# EAGLE design base_module_e1 (EAGLE 9.2.2)
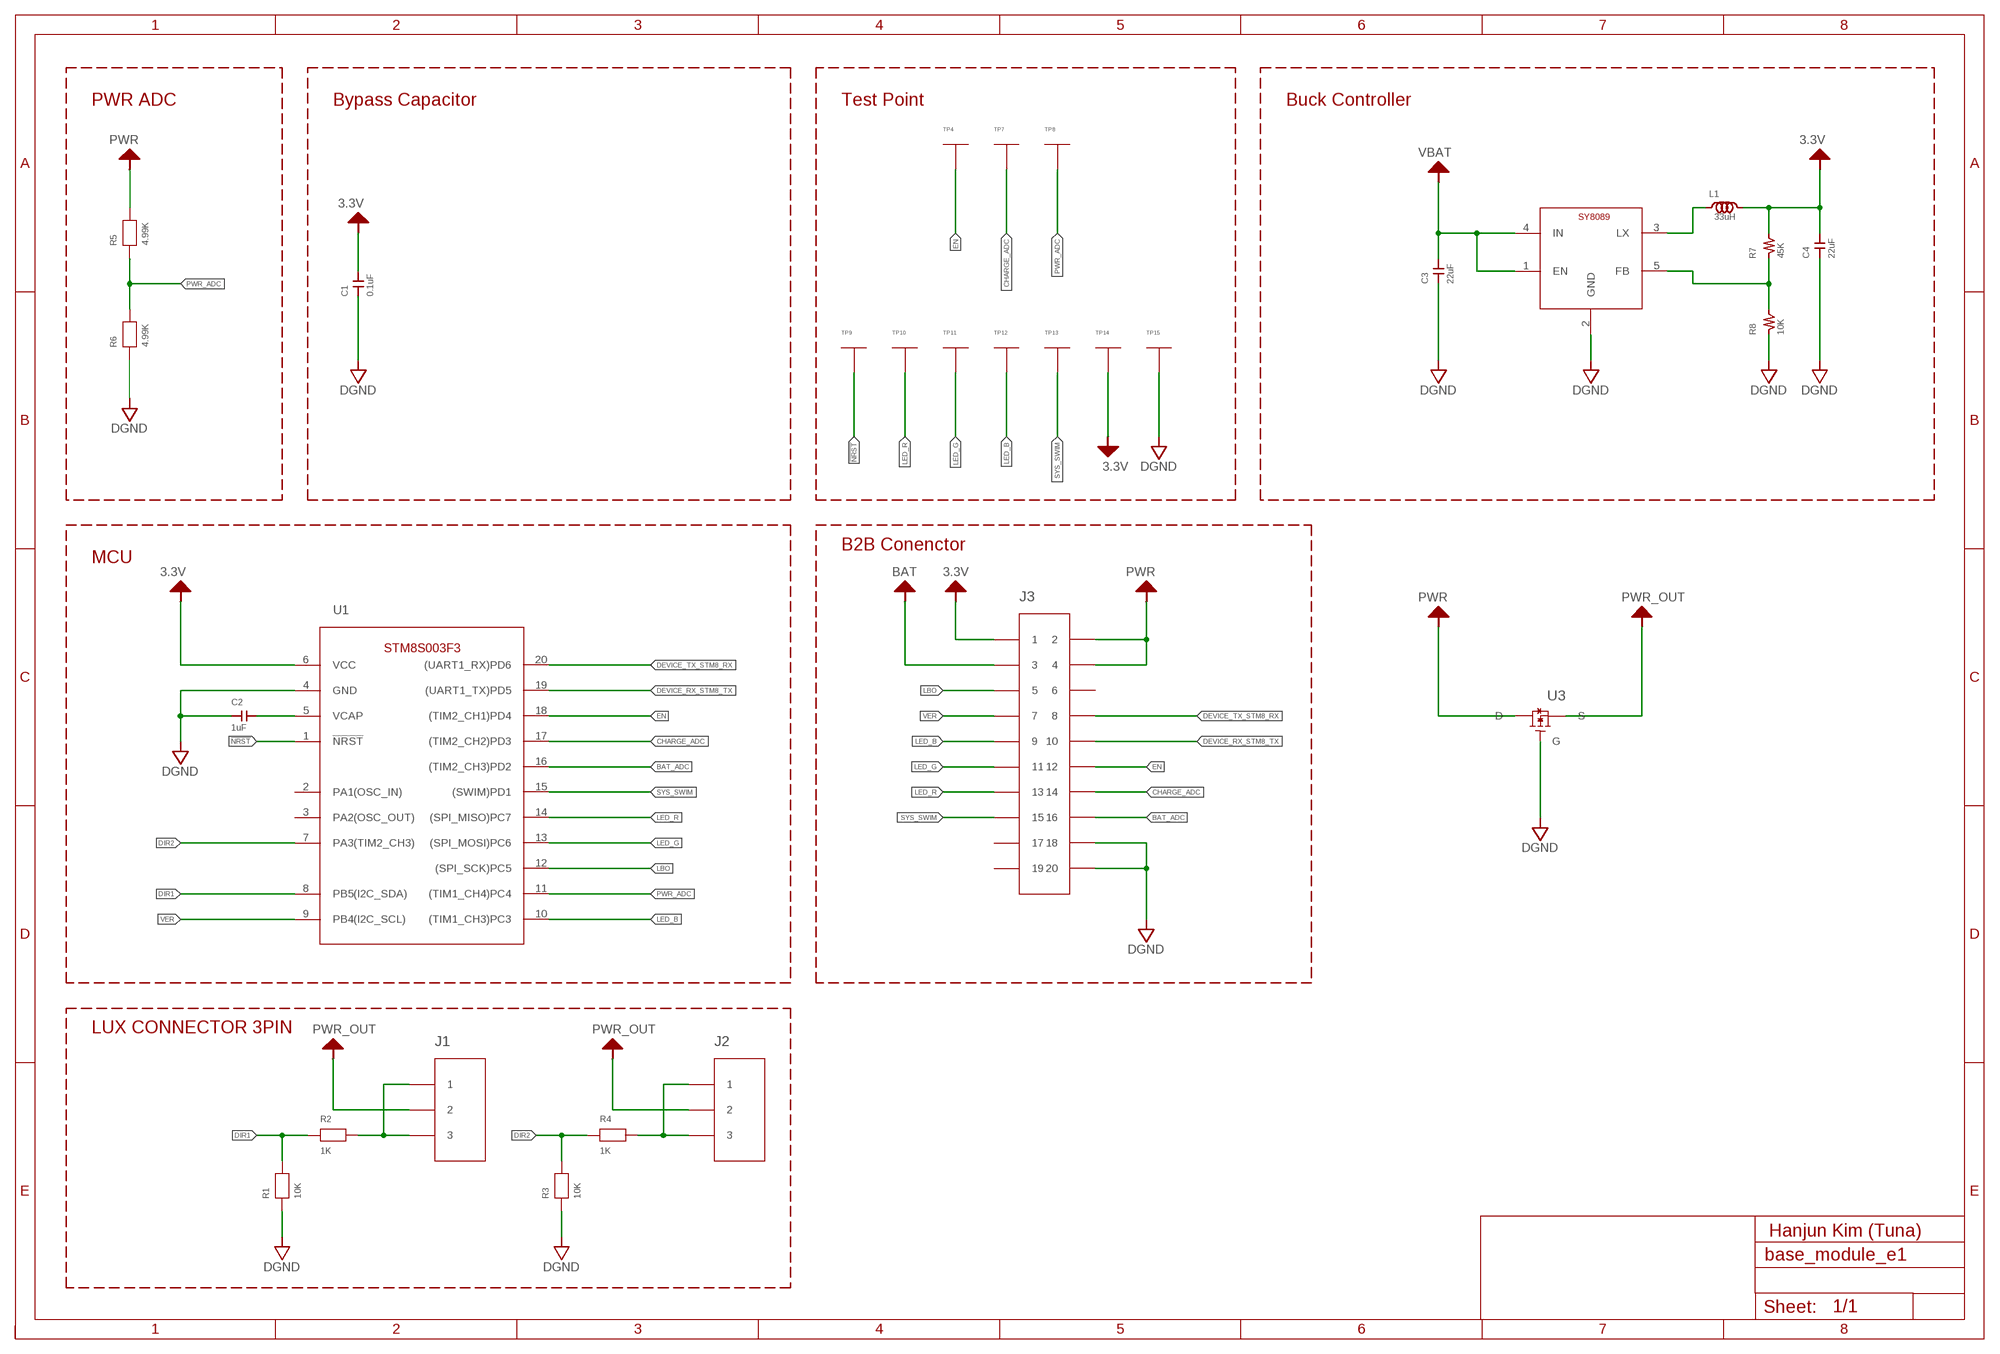
[diagram p0: schematic, sheet 1]

## Parts
C1  0.1uF  CAPACITOR_CHIP1005  [1005]
C2  1uF  CAPACITOR_CHIP1005  [1005]
C3  22uF  CAPACITOR_CHIP1608  [1608]
C4  22uF  CAPACITOR_CHIP1608  [1608]
J1  MODI_CONNECTOR_BOTTOM  [3P]
J2  MODI_CONNECTOR_BOTTOM  [3P]
J3  AXK720447G  [SOCKET_20P]
L1  33uH  INDUCTOR2518  [2518]
P1  MODI_BAT_BASE  [BAT_BASE]
R1  10K  RESISTOR_CHIP_SMALL1005  [1005]
R2  1K  RESISTOR_CHIP_SMALL1005  [1005]
R3  10K  RESISTOR_CHIP_SMALL1005  [1005]
R4  1K  RESISTOR_CHIP_SMALL1005  [1005]
R5  4.99K  RESISTOR_CHIP_SMALL1005  [1005]
R6  4.99K  RESISTOR_CHIP_SMALL1005  [1005]
R7  45K  RESISTOR_CHIP_1005  [1005]
R8  10K  RESISTOR_CHIP_1005  [1005]
TP4  TEST_POINT_1.2MM_PAD  [1.2MM_PAD]
TP7  TEST_POINT_1.2MM_PAD  [1.2MM_PAD]
TP8  TEST_POINT_1.2MM_PAD  [1.2MM_PAD]
TP9  TEST_POINT_1.2MM_PAD  [1.2MM_PAD]
TP10  TEST_POINT_1.2MM_PAD  [1.2MM_PAD]
TP11  TEST_POINT_1.2MM_PAD  [1.2MM_PAD]
TP12  TEST_POINT_1.2MM_PAD  [1.2MM_PAD]
TP13  TEST_POINT  [0.7MM_HOLE]
TP14  TEST_POINT  [0.7MM_HOLE]
TP15  TEST_POINT  [0.7MM_HOLE]
U1  STM8S003FXU6  [UFQFPN20]
U2  SY8089  [SOT-23-5]
U3  PMXBXXXXPE  [DFN1010D-3]

## Nets
3.3V: C1.P$2 C4.P$2 J3.P1 L1.P$2 R7.P$2 TP14.1 U1.6(VCC)
!NRST!: TP9.P1 U1.1(!NRST!)
BAT_ADC: J3.P16 U1.16((TIM2_CH3)PD2)
CHARGE_ADC: J3.P14 TP7.P1 U1.17((TIM2_CH2)PD3)
DEVICE_RX_STM8_TX: J3.P10 U1.19((UART1_TX)PD5)
DEVICE_TX_STM8_RX: J3.P8 U1.20((UART1_RX)PD6)
DGND: C1.P$1 C2.P$1 C3.P$1 C4.P$1 J3.P18 J3.P20 R1.P$1 R3.P$1 R6.P$1 R8.P$1 TP15.1 U1.4(GND) U2.2(GND) U3.P1(G)
DIR1: R1.P$2 R2.P$1 U1.8(PB5(I2C_SDA))
DIR2: R3.P$2 R4.P$1 U1.7(PA3(TIM2_CH3))
EN: J3.P12 TP4.P1 U1.18((TIM2_CH1)PD4)
LBO: J3.P5 U1.12((SPI_SCK)PC5)
LED_B: J3.P9 TP12.P1 U1.10((TIM1_CH3)PC3)
LED_G: J3.P11 TP11.P1 U1.13((SPI_MOSI)PC6)
LED_R: J3.P13 TP10.P1 U1.14((SPI_MISO)PC7)
N$1: J2.P1 J2.P3 R4.P$2
N$3: J1.P1 J1.P3 R2.P$2
N$4: R7.P$1 R8.P$2 U2.5(FB)
N$5: L1.P$1 U2.3(LX)
PWR: J3.P2 J3.P4 R5.P$2 U3.P3(D)
PWR_ADC: R5.P$1 R6.P$2 TP8.P1 U1.11((TIM1_CH4)PC4)
PWR_OUT: J1.P2 J2.P2 U3.P2(S)
SYS_SWIM: J3.P15 TP13.1 U1.15((SWIM)PD1)
VBAT: C3.P$2 J3.P3 U2.1(EN) U2.4(IN) ; supply symbol labelled BAT
VCAP: C2.P$2 U1.5(VCAP)
VER: J3.P7 U1.9(PB4(I2C_SCL))
Unconnected: J3.P6 J3.P17 J3.P19 U1.2(PA1(OSC_IN)) U1.3(PA2(OSC_OUT))

## Notes on the sheet
- PWR ADC | Bypass Capacitor | Test Point | Buck Controller
- B2B Conenctor
- MCU
- LUX CONNECTOR 3PIN
- Hanjun Kim (Tuna)

## Library data of the parts
C1-C4 = passive:CAPACITOR_CHIP
J1 J2 = MODI_Connector:MODI_CONNECTOR_BOTTOM
J3 = connector-panasonic:AXK7204
L1 = passive:INDUCTOR
P1 = MODI_board:MODI_BAT_BASE
R1-R6 = passive:RESISTOR_CHIP_SMALL
R7 R8 = passive:RESISTOR_CHIP_
TP4 TP7-TP15 = Test:TEST_POINT
U1 = ST-MCU:STM8S003FX: • 16 MHz advanced STM8 core with Harvard architecture and 3-stage pipeline • Extended instruction set Memories • Program memory: 8 Kbyte Flash memory; data retention 20 years at 55 °C after 100 cycles • RAM: 1 Kbyte • Data memory: 128 bytes true data EEPROM; endurance up to 100 k write/erase cycles Clock, reset and supply management • 2.95 V to 5.5 V operating voltage • Flexible clock control, 4 master clock sources – Low-power crystal resonator oscillator – External clock input – Internal, user-trimmable 16 MHz RC – Internal low-power 128 kHz RC • Clock security system with clock monitor • Power management – Low-power modes (wait, active-halt, halt) – Switch-off peripheral clocks individually – Permanently active, low-consumption power-on and power-down reset Interrupt management • Nested interrupt controller with 32 interrupts • Up to 27 external interrupts on 6 vectors
U2 = Regulator:SY8089: The SY8089 and SY8089A are high-efficiency, high frequency synchronous step-down DC-DC regulator IC capable of delivering up to 2A output current. The SY8089 and SY8089A operate over a wide input voltage range from 2.7V to 5.5V and integrate main switch and synchronous switch with very low RDS(ON) to minimize the conduction loss. Low output voltage ripple and small external inductor and capacitor sizes are achieved with greater than 1MHz switching frequency. SY8089 integrates short circuit and over-voltage latch off protection.
U3 = MOSFET:PMXBXXXX

## Board
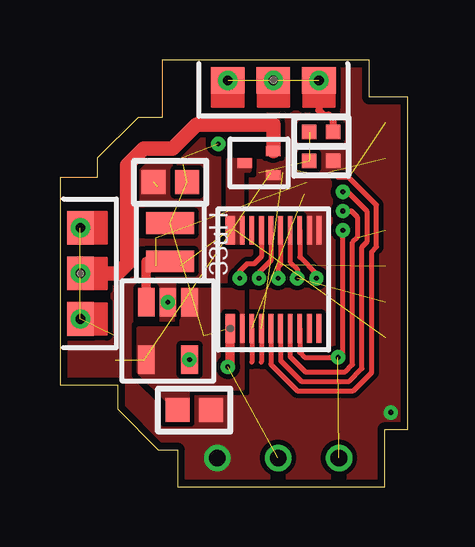
[diagram p1: board, top side]
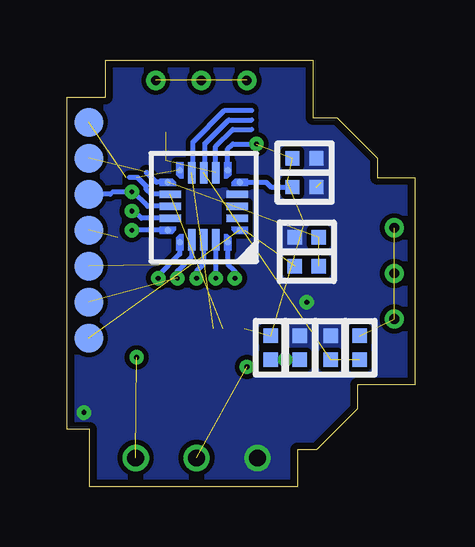
[diagram p2: board, bottom side, seen from below]

Size 14.5 x 17.8 mm. Coordinates in mm from the lower left corner, seen from the top.
Copper layers (1*16): Top 0.035mm / dielectric 0.2mm / Bottom 0.035mm
Design rules "hsdgt3_1oz_2layer": minimum track width 0.2mm, minimum drill 0.2mm, track to track 0.2mm, track to pad 0.2mm, pad to pad 0.2mm, via to via 0.2mm, smd to smd 0mil, copper to edge 0.3mm, drill to drill 8mil, minimum pad ring 0.2mm, minimum via ring 0.2mm, stop-mask expansion 0mil, vias tented up to drill 0.3mm, thermal gap 10mil

### Footprints (pad centres in the part's own frame; a part is rotated, then mirrored left to right if it is on the bottom)
1005 = smd 0.6 x 0.6: P$1 0,0.5; P$2 0,-0.5
1608 = smd 1 x 1: P$1 0,0.7; P$2 0,-0.7
3P = smd 1.1 x 1.4: P1 0,1.9; P2 0,0; P3 0,-1.9
SOCKET_20P = smd 1.2 x 0.4: P1 0,0.1; P2 4.1,0.1 | smd 1.2 x 0.2: P3 0,-0.4; P4 4.1,-0.4; P5 0,-0.8; P6 4.1,-0.8; P7 0,-1.2; P8 4.1,-1.2; P9 0,-1.6; P10 4.1,-1.6; P11 0,-2; P12 4.1,-2; P13 0,-2.4; P14 4.1,-2.4; P15 0,-2.8; P16 4.1,-2.8; P17 0,-3.2; P18 4.1,-3.2; P19 0,-3.6; P20 4.1,-3.6
2518 = smd 0.9 x 2: P$1 -0.8,0; P$2 0.8,0
1.2MM_PAD = smd 1.2 x 1.2: P1 0,0
0.7MM_HOLE = drill 0.7: 1 0,0
UFQFPN20 = smd 0.3 x 0.3: 1 -1.5,1; 5 -1.5,-1; 6 -1,-1.5; 10 1,-1.5; 11 1.5,-1; 15 1.5,1; 16 1,1.5; 20 -1,1.5 | smd 0.9 x 0.3: 2 -1.4,0.5; 3 -1.4,0; 4 -1.4,-0.5; 12 1.4,-0.5; 13 1.4,0; 14 1.4,0.5 | smd 0.3 x 0.9: 7 -0.5,-1.4; 8 0,-1.4; 9 0.5,-1.4; 17 0.5,1.4; 18 0,1.4; 19 -0.5,1.4
SOT-23-5 = smd 0.7 x 1.2: 1 1.8,0; 2 0.9,0; 3 0,0; 4 0,-2.4; 5 1.8,-2.4
DFN1010D-3 = smd 0.4 x 0.6: P1 0.5,0.9; P2 -0.5,0.9; P3 0,-0.3

### Placement (x,y rotation side)
C1  4.6,13.7 270 bottom
C2  4.6,12.5 270 bottom
C3  5.6,3.2 270 top
C4  4.6,12.7 90 top
J1  0.85,8.9 0 top
J2  8.9,16.95 270 top
J3  7.2,6.6 90 top
L1  4.6,10.2 90 top
P1  4.9,0 0 top
R1  3.5,5.8 0 bottom
R2  2.3,5.8 180 bottom
R3  10.9,13.6 270 top
R4  10.9,14.8 90 top
R5  4.5,9.2 270 bottom
R6  4.5,10.4 90 bottom
R7  6,5.8 180 bottom
R8  4.8,5.8 0 bottom
TP4  13.6,9.2 0 bottom
TP7  13.6,7.7 180 bottom
TP8  13.6,13.7 0 bottom
TP9  13.6,6.2 0 bottom
TP10  13.6,10.7 0 bottom
TP11  13.6,12.2 0 bottom
TP12  13.6,15.2 0 bottom
TP13  11.64,1.2 0 top
TP14  9.1,1.2 0 top
TP15  6.56,1.2 0 top
U1  8.8,11.7 180 bottom
U2  3.6,7.7 0 top
U3  8,13.5 270 top

### Tracks (layer width: path | path; a pad name or v marks a point on that pad's centre or on a via)
3.3V  (via drill 0.2)  (6 unrouted)
  Top 0.4: J3.P1 7.1,5.1 v7,5
  Bottom 0.2: U1.6 7.8,14.1 7.6,14.3 v6.6,14.3
!NRST!  (1 unrouted)
BAT_ADC  (via drill 0.2)
  Top 0.2: J3.P16 10,9.58 10.7,8.88 v10.7,8.7
  Bottom 0.2: U1.16 9.8,9.7 10.7,8.8 v10.7,8.7
CHARGE_ADC  (via drill 0.2)  (1 unrouted)
  Top 0.2: J3.P14 9.6,9.38 9.9,9.08 v9.9,8.7
  Bottom 0.2: v9.9,8.7 9.9,9 9.3,9.6 U1.17
DEVICE_RX_STM8_TX  (via drill 0.2)
  Top 0.2: J3.P10 8.8,9.43 8.3,8.93 v8.3,8.7
  Bottom 0.2: U1.19 v8.3,8.7
DEVICE_TX_STM8_RX  (via drill 0.2)
  Top 0.2: J3.P8 8.4,9.6 8.1,9.3 7.8,9.3 7.5,9 v7.5,8.7
  Bottom 0.2: U1.20 7.8,9.3 7.5,9 v7.5,8.7
DGND  (via drill 0.2)  (1 unrouted)
  other vias: 4.5,7.7 13.8,3.1
  pour Bottom (isolate 0.2, rank 6, no thermals): -0.4,19.7 14.6,19.7 14.6,-0.3 -0.4,-0.3
  pour Top (isolate 0.2, rank 6, no thermals): -0.4,19.7 14.6,19.7 14.6,-0.3 -0.4,-0.3
DIR1  (2 unrouted)
  Bottom 0.2: U1.8 8.75,13.15 8.75,14.32 7.77,15.3 6.8,15.3
DIR2  (2 unrouted)
  Bottom 0.2: U1.7 8.3,14.2 7.6,14.9 6.8,14.9
EN  (via drill 0.2)  (1 unrouted)
  Top 0.2: J3.P12 9.2,9.27 9.1,9.17 v9.1,8.7
  Bottom 0.2: U1.18 8.8,9.3 9.1,9 v9.1,8.7
LBO  (1 unrouted)
  Top 0.2: J3.P5 8,5.2
  Bottom 0.2: U1.12 11,12.2 11.2,12.4 11.2,12.55 11.55,12.9 11.9,12.9
LED_B  (2 unrouted)
  Top 0.2: J3.P9 8.8,5.1 9.9,4 12.23,4 13,4.77 13,9.8 13.2,10 13.2,11.75 12.05,12.9 11.6,12.9
LED_G  (via drill 0.2)
  Top 0.2: J3.P11 9.2,5.27 10.07,4.4 12.07,4.4 12.6,4.93 12.6,10 12.8,10.2 12.8,11.5 12,12.3 v11.8,12.3
  Bottom 0.2: U1.13 11.15,11.7 11.75,12.3 v11.8,12.3 12.6,12.3 12.7,12.2 TP11.P1
LED_R  (via drill 0.2)  (1 unrouted)
  Top 0.2: J3.P13 9.6,5.43 10.23,4.8 11.9,4.8 12.2,5.1 12.2,10.2 12.4,10.4 12.4,11.25 12.15,11.5 v11.8,11.5
  Bottom 0.2: v11.8,11.5 11.7,11.5 11.4,11.2 U1.14
N$1  (via drill 0.4)  (1 unrouted)
  Top 0.3: R4.P$2 11.4,15.3 11.2,15.5 11,15.5 10.8,15.7 J2.P1
  other vias: 10.8,16.95 7,16.95
N$3  (via drill 0.4)  (2 unrouted)
  other vias: 0.85,7 0.85,10.8
N$4  (via drill 0.2)
  Bottom 0.2: R8.P$2 U2.5 R7.P$1
  other vias: 5.4,5.3
N$5
  Top 0.4: U2.3 3.6,9.4 L1.P$1
PWR  (1 unrouted)
  pour Top (isolate 0.2, no thermals): 7,10.2 7.6,10.2 7.6,13.2 7.9,13.2 7.9,13.6 7,13.6
PWR_ADC  (3 unrouted)
  Bottom 0.2: U1.11 10.79,12.7 11.2,13.11
PWR_OUT  (via drill 0.4)
  Top 0.6: U3.P2 8.9,15.1 5.7,15.1 4.7,14.1 3.49,14.1 2.8,13.41 2.8,9.3 2.4,8.9 J1.P2
  other vias: 0.85,8.9 8.9,16.95
  pour Top (isolate 0.2, no thermals): 8.7,13.9 9.1,13.9 9.1,17.4 8.7,17.4
SYS_SWIM  (via drill 0.2)  (1 unrouted)
  Top 0.2: J3.P15 10,5.6 10.2,5.4 v11.6,5.4 11.8,5.6 v11.8,10.7
  Bottom 0.2: U1.15 v11.8,10.7
VBAT
  pour Top (isolate 0.2, rank 2, no thermals): 5.1,8.2 7.6,8.2 7.6,4.1 5.3,4.1 5.3,2.8 4.5,2.8 4.5,3.6 3.3,4.8 3.3,6.6 5.1,6.6
VCAP
  Bottom 0.2: U1.5 6.2,12.7 6,12.5 C2.P$2
VER  (1 unrouted)
  Top 0.2: J3.P7 8.4,5.2
  Bottom 0.2: U1.9 9.25,13.15 9.25,14.38 7.93,15.7 6.8,15.7